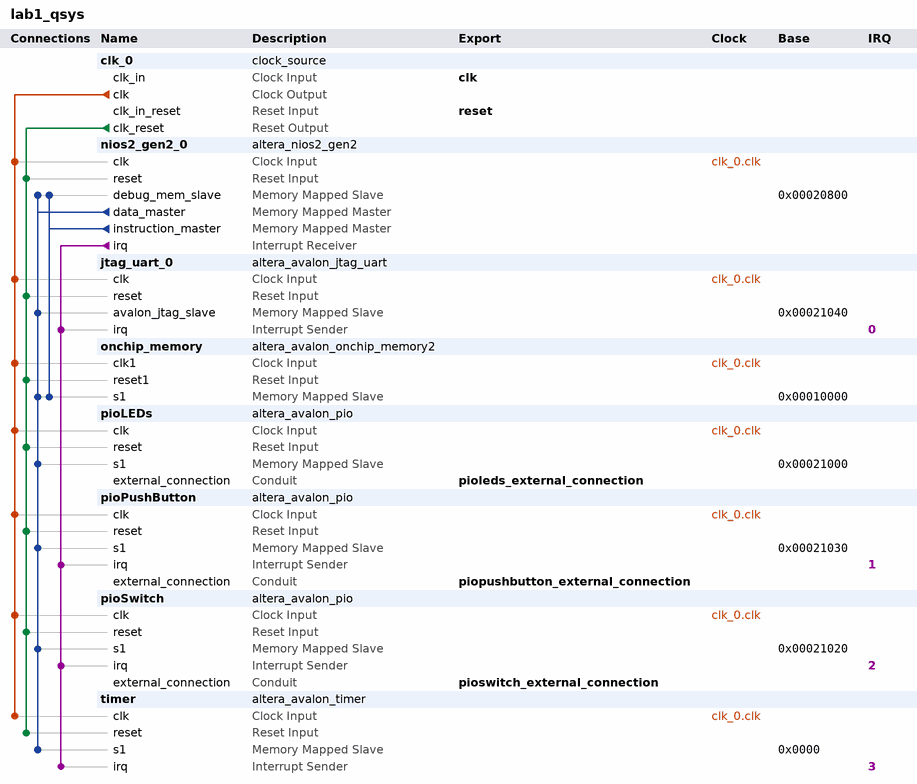
[diagram p0: system contents]
# Platform Designer (Qsys) system lab1_qsys, MAX 10 10M50DAF484C7G
# Parameters at their usual value, and those the tool derives, are not listed.
package require -exact qsys 18.0
create_system lab1_qsys
set_project_property DEVICE_FAMILY {MAX 10}
set_project_property DEVICE 10M50DAF484C7G

add_instance clk_0 clock_source 18.0
set_instance_parameter_value clk_0 clockFrequency 50000000

add_instance nios2_gen2_0 altera_nios2_gen2 18.0
set_instance_parameter_value nios2_gen2_0 dcache_size 2048
set_instance_parameter_value nios2_gen2_0 exceptionSlave onchip_memory.s1
set_instance_parameter_value nios2_gen2_0 icache_size 4096
set_instance_parameter_value nios2_gen2_0 impl Tiny
set_instance_parameter_value nios2_gen2_0 resetSlave onchip_memory.s1

add_instance jtag_uart_0 altera_avalon_jtag_uart 18.0
set_instance_parameter_value jtag_uart_0 simInteractiveOptions NO_INTERACTIVE_WINDOWS

add_instance onchip_memory altera_avalon_onchip_memory2 18.0
set_instance_parameter_value onchip_memory dataWidth 32
set_instance_parameter_value onchip_memory dualPort false
set_instance_parameter_value onchip_memory initMemContent true
set_instance_parameter_value onchip_memory initializationFileName {C:/Users/User/Documents/Conception conjointe/FAUGERE_Lab1/software/app/mem_init/lab1_qsys_onchip_memory.hex}
set_instance_parameter_value onchip_memory memorySize 40000
set_instance_parameter_value onchip_memory useNonDefaultInitFile true

add_instance pioLEDs altera_avalon_pio 18.0
set_instance_parameter_value pioLEDs bitModifyingOutReg true
set_instance_parameter_value pioLEDs direction Output
set_instance_parameter_value pioLEDs width 10

add_instance pioPushButton altera_avalon_pio 18.0
set_instance_parameter_value pioPushButton bitClearingEdgeCapReg true
set_instance_parameter_value pioPushButton captureEdge true
set_instance_parameter_value pioPushButton direction Input
set_instance_parameter_value pioPushButton edgeType FALLING
set_instance_parameter_value pioPushButton generateIRQ true
set_instance_parameter_value pioPushButton irqType EDGE
set_instance_parameter_value pioPushButton width 1

add_instance pioSwitch altera_avalon_pio 18.0
set_instance_parameter_value pioSwitch bitClearingEdgeCapReg true
set_instance_parameter_value pioSwitch captureEdge true
set_instance_parameter_value pioSwitch direction Input
set_instance_parameter_value pioSwitch edgeType ANY
set_instance_parameter_value pioSwitch generateIRQ true
set_instance_parameter_value pioSwitch irqType EDGE
set_instance_parameter_value pioSwitch width 4

add_instance timer altera_avalon_timer 18.0
set_instance_parameter_value timer period 100
set_instance_parameter_value timer periodUnits MSEC

# connections
add_connection clk_0.clk jtag_uart_0.clk clock
add_connection clk_0.clk nios2_gen2_0.clk clock
add_connection clk_0.clk onchip_memory.clk1 clock
add_connection clk_0.clk pioLEDs.clk clock
add_connection clk_0.clk pioPushButton.clk clock
add_connection clk_0.clk pioSwitch.clk clock
add_connection clk_0.clk timer.clk clock
add_connection clk_0.clk_reset jtag_uart_0.reset reset
add_connection clk_0.clk_reset nios2_gen2_0.reset reset
add_connection clk_0.clk_reset onchip_memory.reset1 reset
add_connection clk_0.clk_reset pioLEDs.reset reset
add_connection clk_0.clk_reset pioPushButton.reset reset
add_connection clk_0.clk_reset pioSwitch.reset reset
add_connection clk_0.clk_reset timer.reset reset
add_connection nios2_gen2_0.data_master jtag_uart_0.avalon_jtag_slave avalon
set_connection_parameter_value nios2_gen2_0.data_master/jtag_uart_0.avalon_jtag_slave baseAddress 0x00021040
add_connection nios2_gen2_0.data_master nios2_gen2_0.debug_mem_slave avalon
set_connection_parameter_value nios2_gen2_0.data_master/nios2_gen2_0.debug_mem_slave baseAddress 0x00020800
add_connection nios2_gen2_0.data_master onchip_memory.s1 avalon
set_connection_parameter_value nios2_gen2_0.data_master/onchip_memory.s1 baseAddress 0x00010000
add_connection nios2_gen2_0.data_master pioLEDs.s1 avalon
set_connection_parameter_value nios2_gen2_0.data_master/pioLEDs.s1 baseAddress 0x00021000
add_connection nios2_gen2_0.data_master pioPushButton.s1 avalon
set_connection_parameter_value nios2_gen2_0.data_master/pioPushButton.s1 baseAddress 0x00021030
add_connection nios2_gen2_0.data_master pioSwitch.s1 avalon
set_connection_parameter_value nios2_gen2_0.data_master/pioSwitch.s1 baseAddress 0x00021020
add_connection nios2_gen2_0.data_master timer.s1 avalon
set_connection_parameter_value nios2_gen2_0.data_master/timer.s1 baseAddress 0x0000
add_connection nios2_gen2_0.instruction_master nios2_gen2_0.debug_mem_slave avalon
set_connection_parameter_value nios2_gen2_0.instruction_master/nios2_gen2_0.debug_mem_slave baseAddress 0x00020800
add_connection nios2_gen2_0.instruction_master onchip_memory.s1 avalon
set_connection_parameter_value nios2_gen2_0.instruction_master/onchip_memory.s1 baseAddress 0x00010000
add_connection nios2_gen2_0.irq jtag_uart_0.irq interrupt
set_connection_parameter_value nios2_gen2_0.irq/jtag_uart_0.irq irqNumber 0
add_connection nios2_gen2_0.irq pioPushButton.irq interrupt
set_connection_parameter_value nios2_gen2_0.irq/pioPushButton.irq irqNumber 1
add_connection nios2_gen2_0.irq pioSwitch.irq interrupt
set_connection_parameter_value nios2_gen2_0.irq/pioSwitch.irq irqNumber 2
add_connection nios2_gen2_0.irq timer.irq interrupt
set_connection_parameter_value nios2_gen2_0.irq/timer.irq irqNumber 3

# exported interfaces
add_interface clk clock sink
set_interface_property clk EXPORT_OF clk_0.clk_in
add_interface pioleds_external_connection conduit end
set_interface_property pioleds_external_connection EXPORT_OF pioLEDs.external_connection
add_interface piopushbutton_external_connection conduit end
set_interface_property piopushbutton_external_connection EXPORT_OF pioPushButton.external_connection
add_interface pioswitch_external_connection conduit end
set_interface_property pioswitch_external_connection EXPORT_OF pioSwitch.external_connection
add_interface reset reset sink
set_interface_property reset EXPORT_OF clk_0.clk_in_reset

set_interconnect_requirement {$system} qsys_mm.clockCrossingAdapter HANDSHAKE
set_interconnect_requirement {$system} qsys_mm.enableEccProtection FALSE
set_interconnect_requirement {$system} qsys_mm.insertDefaultSlave FALSE
set_interconnect_requirement {$system} qsys_mm.maxAdditionalLatency 1

save_system lab1_qsys.qsys
